# Altium schematic sheet rs485_sensors.SchDoc
size A4; SheetNumber: 5; SheetTotal: 13
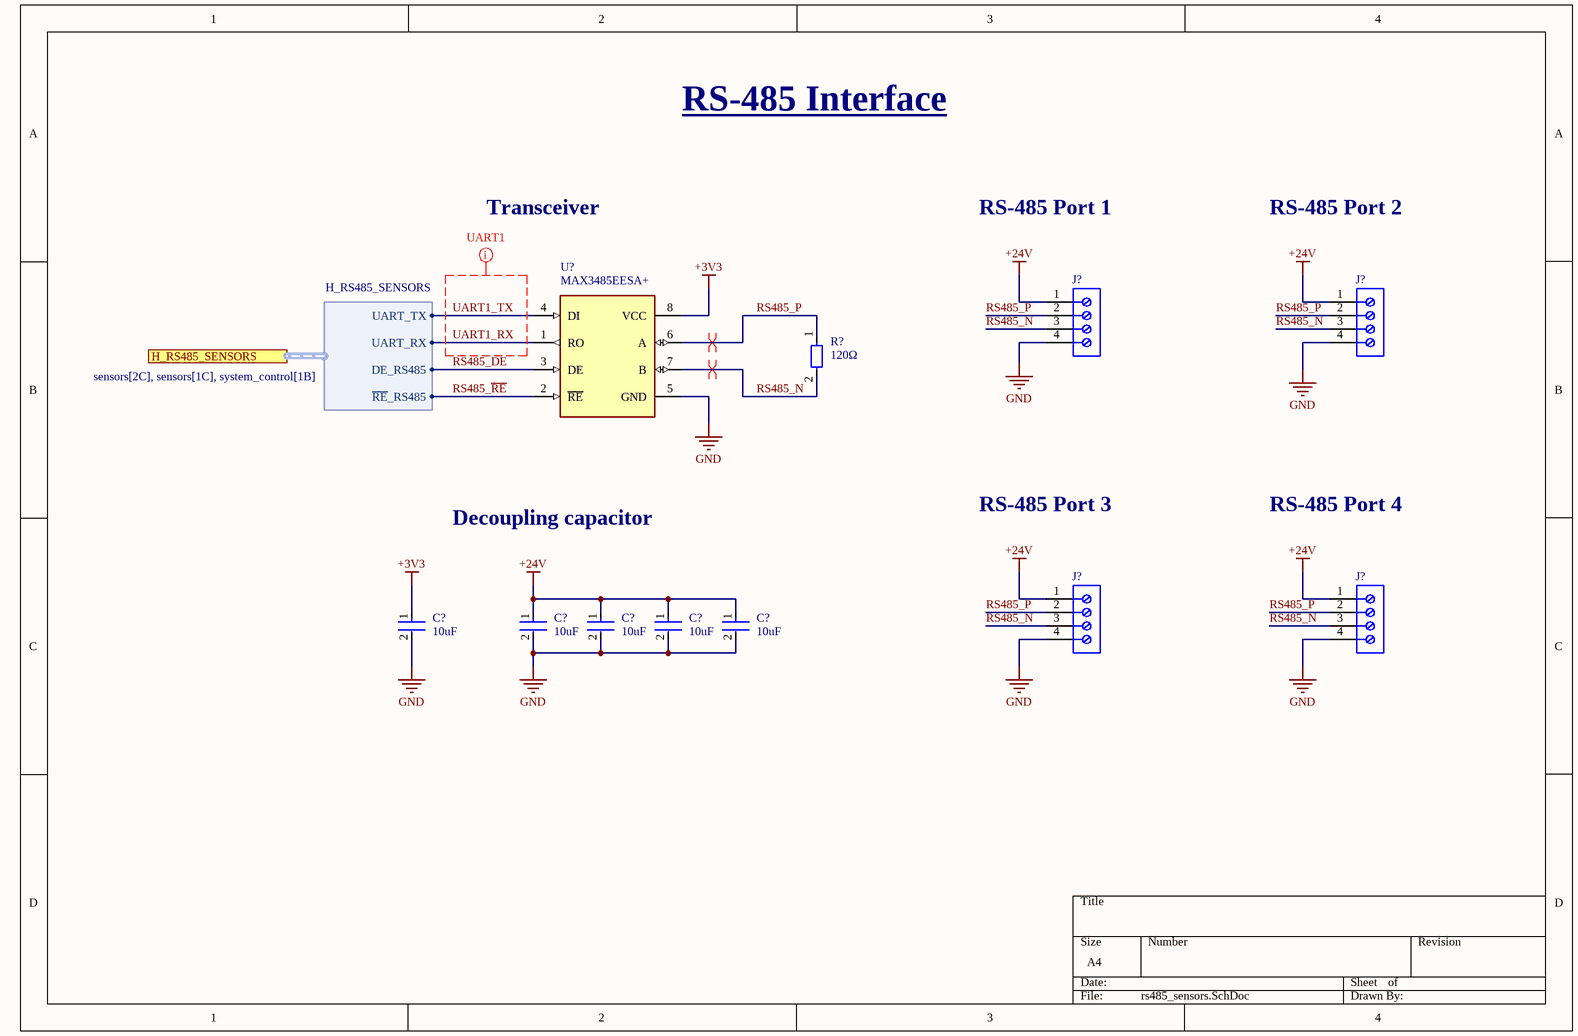
[diagram p0: rs485_sensors.SchDoc]

## Parts
(Parts that share a designator on the sheet are numbered #1, #2 ... from top to bottom, then left to right.)
C?#1  Capacitance: 10uF  [CAP_0805]  (hidden comment: Simbolo de capacitor genérico)
C?#2  Capacitance: 10uF  [CAP_0805]  (hidden comment: Simbolo de capacitor genérico)
C?#3  Capacitance: 10uF  [CAP_0805]  (hidden comment: Simbolo de capacitor genérico)
C?#4  Capacitance: 10uF  [CAP_0805]  (hidden comment: Simbolo de capacitor genérico)
C?#5  Capacitance: 10uF  [CAP_0805]  (hidden comment: Simbolo de capacitor genérico)
J?#1  691137710004  [691137710004]  (value not drawn)
J?#2  691137710004  [691137710004]  (value not drawn)
J?#3  691137710004  [691137710004]  (value not drawn)
J?#4  691137710004  [691137710004]  (value not drawn)
R?  value 120Ω  [RES_0805]  (hidden comment: Simbolo de resistencia genérica)
U?  MAX3485EESA+  [SOIC8]

## Ports
H_RS485_SENSORS (harness H_RS485_SENSORS, see sensors[2C], sensors[1C], system_control[1B])

## Harnesses
H_RS485_SENSORS: UART_TX, UART_RX, DE_RS485, ~{RE}_RS485

## Nets
+3V3: C?#1.1 U?.8(VCC)
+24V: C?#2.1 C?#3.1 C?#4.1 C?#5.1 J?#1.1 J?#2.1 J?#3.1 J?#4.1
GND: C?#1.2 C?#2.2 C?#3.2 C?#4.2 C?#5.2 J?#1.4 J?#2.4 J?#3.4 J?#4.4 U?.5(GND)
RS485_DE: U?.3(DE) ; port H_RS485_SENSORS.DE_RS485
RS485_N: J?#1.3 J?#2.3 J?#3.3 J?#4.3 R?.2 U?.7(B)
RS485_P: J?#1.2 J?#2.2 J?#3.2 J?#4.2 R?.1 U?.6(A)
RS485_~{RE}: U?.2(~{RE}) ; port H_RS485_SENSORS.~{RE}_RS485
UART1_RX: U?.1(RO) ; port H_RS485_SENSORS.UART_RX
UART1_TX: U?.4(DI) ; port H_RS485_SENSORS.UART_TX

## Layout directives
differential pair; differential pair class RS485: RS485_N, RS485_P
net class UART1: UART1_RX, UART1_TX

## Notes on the sheet
- RS-485 Interface
- Transceiver
- RS-485 Port 1
- RS-485 Port 2
- RS-485 Port 3
- RS-485 Port 4
- Decoupling capacitor

## Library data of the parts
C?#1-C?#5 = Generic C: Dielectric: X5R; Voltage Rating: 10V; Tolerance: 10%; Case Code (Imperial): 0805; Mount: Surface Mount; Depth: 1.25mm; Length: 2mm; Lead Free: Lead Free; Packaging: Tape and Reel; Width: 0.049inch; Package Quantity: 1; Height: 1.25mm; Case/Package: 0805; Thickness: 0.053inch; Max Operating Temperature: 85°C; Case Code (Metric): 2012; Contact Plating: Tin; Min Operating Temperature: -55°C; Radiation Hardening: No; Voltage Rating (DC): 10V
J?#1-J?#4 = CMP-1502-03326-2: NexarPartId: 78871140; Packaging: Box; RoHS: Non-Compliant; Number of Pins: 4; Lead Pitch: 5mm
R? = Generic R
U? = MAX3485EESA+: Low-power, 3.3V RS-485/RS-422 Transceiver, Half-Duplex; Manufacturer: Maxim Integrated / Analog Devices; MPN: MAX3485ESA+T; Interface: RS-485, RS-422; Number of transmitters: 1; Min Supply Voltage: 3V; Max Supply Voltage: 3.6V; Data rate: 10 Mbps; Number of receivers: 1; Operating temperature range: -40°C to +85°C; Datasheet: https://www.analog.com/media/en/technical-documentation/data-sheets/MAX3483-MAX3491.pdf